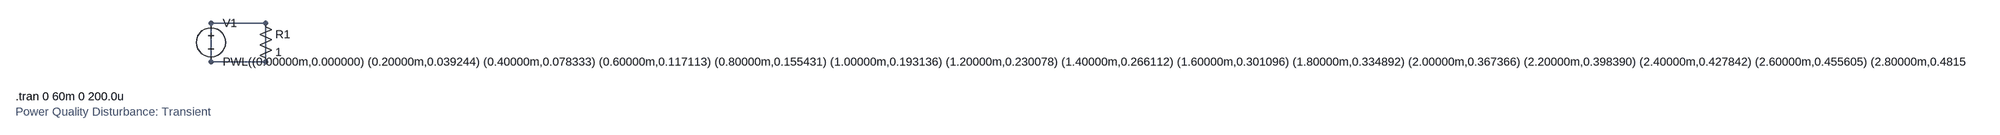
[diagram p0: schematic Transient.asc]
Transient.asc, the LTspice schematic file:
Version 4
SHEET 1 880 680
WIRE 192 128 80 128
WIRE 80 128 80 208
WIRE 192 208 80 208
WIRE 192 128 192 208
SYMBOL voltage 80 112 R0
WINDOW 123 0 0 Left 0
WINDOW 39 0 0 Left 0
SYMATTR InstName V1
SYMATTR Value PWL((0.00000m,0.000000) (0.20000m,0.039244) (0.40000m,0.078333) (0.60000m,0.117113) (0.80000m,0.155431) (1.00000m,0.193136) (1.20000m,0.230078) (1.40000m,0.266112) (1.60000m,0.301096) (1.80000m,0.334892) (2.00000m,0.367366) (2.20000m,0.398390) (2.40000m,0.427842) (2.60000m,0.455605) (2.80000m,0.481571) (3.00000m,0.505636) (3.20000m,0.527705) (3.40000m,0.547692) (3.60000m,0.565517) (3.80000m,0.581110) (4.00000m,0.594410) (4.20000m,0.605364) (4.40000m,0.613930) (4.60000m,0.620072) (4.80000m,0.623767) (5.00000m,0.625000) (5.20000m,0.623767) (5.40000m,0.620072) (5.60000m,0.613930) (5.80000m,0.605364) (6.00000m,0.594410) (6.20000m,0.581110) (6.40000m,0.565517) (6.60000m,0.547692) (6.80000m,0.527705) (7.00000m,0.505636) (7.20000m,0.481571) (7.40000m,0.455605) (7.60000m,0.427842) (7.80000m,0.398390) (8.00000m,0.367366) (8.20000m,0.334892) (8.40000m,0.301096) (8.60000m,0.266112) (8.80000m,0.230078) (9.00000m,0.193136) (9.20000m,0.155431) (9.40000m,0.117113) (9.60000m,0.078333) (9.80000m,0.039244) (10.00000m,0.000000) (10.20000m,-0.039244) (10.40000m,-0.078333) (10.60000m,-0.117113) (10.80000m,-0.155431) (11.00000m,-0.193136) (11.20000m,-0.230078) (11.40000m,-0.266112) (11.60000m,-0.301096) (11.80000m,-0.334892) (12.00000m,-0.367366) (12.20000m,-0.398390) (12.40000m,-0.427842) (12.60000m,-0.455605) (12.80000m,-0.481571) (13.00000m,-0.505636) (13.20000m,-0.527705) (13.40000m,-0.547692) (13.60000m,-0.565517) (13.80000m,-0.581110) (14.00000m,-0.594410) (14.20000m,-0.605364) (14.40000m,-0.613930) (14.60000m,-0.620072) (14.80000m,-0.623767) (15.00000m,-0.625000) (15.20000m,-0.623767) (15.40000m,-0.620072) (15.60000m,-0.613930) (15.80000m,-0.605364) (16.00000m,-0.594410) (16.20000m,-0.581110) (16.40000m,-0.565517) (16.60000m,-0.547692) (16.80000m,-0.527705) (17.00000m,-0.505636) (17.20000m,-0.481571) (17.40000m,-0.455605) (17.60000m,-0.427842) (17.80000m,-0.398390) (18.00000m,-0.367366) (18.20000m,-0.334892) (18.40000m,-0.301096) (18.60000m,-0.266112) (18.80000m,-0.230078) (19.00000m,-0.193136) (19.20000m,-0.155431) (19.40000m,-0.117113) (19.60000m,-0.078333) (19.80000m,-0.039244) (20.00000m,-0.000000) (20.20000m,0.039244) (20.40000m,0.078333) (20.60000m,0.117113) (20.80000m,0.155431) (21.00000m,0.193136) (21.20000m,0.230078) (21.40000m,0.266112) (21.60000m,0.301096) (21.80000m,0.334892) (22.00000m,0.367366) (22.20000m,0.398390) (22.40000m,0.427842) (22.60000m,0.455605) (22.80000m,0.481571) (23.00000m,0.505636) (23.20000m,0.527705) (23.40000m,0.547692) (23.60000m,0.565517) (23.80000m,0.581110) (24.00000m,0.594410) (24.20000m,0.605364) (24.40000m,0.613930) (24.60000m,0.620072) (24.80000m,0.623767) (25.00000m,0.625000) (25.20000m,0.623767) (25.40000m,0.620072) (25.60000m,0.613930) (25.80000m,0.605364) (26.00000m,0.594410) (26.20000m,0.581110) (26.40000m,0.565517) (26.60000m,0.547692) (26.80000m,0.527705) (27.00000m,0.505636) (27.20000m,0.481571) (27.40000m,0.455605) (27.60000m,0.427842) (27.80000m,0.398390) (28.00000m,0.367366) (28.20000m,0.334892) (28.40000m,0.301096) (28.60000m,0.266112) (28.80000m,0.230078) (29.00000m,0.193136) (29.20000m,0.155431) (29.40000m,0.117113) (29.60000m,0.078333) (29.80000m,0.039244) (30.00000m,1.000000) (30.20000m,0.328635) (30.40000m,0.057002) (30.60000m,-0.067326) (30.80000m,-0.137116) (31.00000m,-0.186398) (31.20000m,-0.227599) (31.40000m,-0.266112) (31.60000m,-0.301096) (31.80000m,-0.334892) (32.00000m,-0.367366) (32.20000m,-0.398390) (32.40000m,-0.427842) (32.60000m,-0.455605) (32.80000m,-0.481571) (33.00000m,-0.505636) (33.20000m,-0.527705) (33.40000m,-0.547692) (33.60000m,-0.565517) (33.80000m,-0.581110) (34.00000m,-0.594410) (34.20000m,-0.605364) (34.40000m,-0.613930) (34.60000m,-0.620072) (34.80000m,-0.623767) (35.00000m,-0.625000) (35.20000m,-0.623767) (35.40000m,-0.620072) (35.60000m,-0.613930) (35.80000m,-0.605364) (36.00000m,-0.594410) (36.20000m,-0.581110) (36.40000m,-0.565517) (36.60000m,-0.547692) (36.80000m,-0.527705) (37.00000m,-0.505636) (37.20000m,-0.481571) (37.40000m,-0.455605) (37.60000m,-0.427842) (37.80000m,-0.398390) (38.00000m,-0.367366) (38.20000m,-0.334892) (38.40000m,-0.301096) (38.60000m,-0.266112) (38.80000m,-0.230078) (39.00000m,-0.193136) (39.20000m,-0.155431) (39.40000m,-0.117113) (39.60000m,-0.078333) (39.80000m,-0.039244) (40.00000m,-0.000000) (40.20000m,0.039244) (40.40000m,0.078333) (40.60000m,0.117113) (40.80000m,0.155431) (41.00000m,0.193136) (41.20000m,0.230078) (41.40000m,0.266112) (41.60000m,0.301096) (41.80000m,0.334892) (42.00000m,0.367366) (42.20000m,0.398390) (42.40000m,0.427842) (42.60000m,0.455605) (42.80000m,0.481571) (43.00000m,0.505636) (43.20000m,0.527705) (43.40000m,0.547692) (43.60000m,0.565517) (43.80000m,0.581110) (44.00000m,0.594410) (44.20000m,0.605364) (44.40000m,0.613930) (44.60000m,0.620072) (44.80000m,0.623767) (45.00000m,0.625000) (45.20000m,0.623767) (45.40000m,0.620072) (45.60000m,0.613930) (45.80000m,0.605364) (46.00000m,0.594410) (46.20000m,0.581110) (46.40000m,0.565517) (46.60000m,0.547692) (46.80000m,0.527705) (47.00000m,0.505636) (47.20000m,0.481571) (47.40000m,0.455605) (47.60000m,0.427842) (47.80000m,0.398390) (48.00000m,0.367366) (48.20000m,0.334892) (48.40000m,0.301096) (48.60000m,0.266112) (48.80000m,0.230078) (49.00000m,0.193136) (49.20000m,0.155431) (49.40000m,0.117113) (49.60000m,0.078333) (49.80000m,0.039244) (50.00000m,0.000000) (50.20000m,-0.039244) (50.40000m,-0.078333) (50.60000m,-0.117113) (50.80000m,-0.155431) (51.00000m,-0.193136) (51.20000m,-0.230078) (51.40000m,-0.266112) (51.60000m,-0.301096) (51.80000m,-0.334892) (52.00000m,-0.367366) (52.20000m,-0.398390) (52.40000m,-0.427842) (52.60000m,-0.455605) (52.80000m,-0.481571) (53.00000m,-0.505636) (53.20000m,-0.527705) (53.40000m,-0.547692) (53.60000m,-0.565517) (53.80000m,-0.581110) (54.00000m,-0.594410) (54.20000m,-0.605364) (54.40000m,-0.613930) (54.60000m,-0.620072) (54.80000m,-0.623767) (55.00000m,-0.625000) (55.20000m,-0.623767) (55.40000m,-0.620072) (55.60000m,-0.613930) (55.80000m,-0.605364) (56.00000m,-0.594410) (56.20000m,-0.581110) (56.40000m,-0.565517) (56.60000m,-0.547692) (56.80000m,-0.527705) (57.00000m,-0.505636) (57.20000m,-0.481571) (57.40000m,-0.455605) (57.60000m,-0.427842) (57.80000m,-0.398390) (58.00000m,-0.367366) (58.20000m,-0.334892) (58.40000m,-0.301096) (58.60000m,-0.266112) (58.80000m,-0.230078) (59.00000m,-0.193136) (59.20000m,-0.155431) (59.40000m,-0.117113) (59.60000m,-0.078333) (59.80000m,-0.039244))
SYMBOL res 176 112 R0
SYMATTR InstName R1
SYMATTR Value 1
TEXT -320 280 Left 2 !.tran 0 60m 0 200.0u
TEXT -320 312 Left 2 ;Power Quality Disturbance: Transient

The netlist it stands for:
* Transient.asc
V1 N001 N001 PWL((0.00000m,0.000000) (0.20000m,0.039244) (0.40000m,0.078333) (0.60000m,0.117113) (0.80000m,0.155431) (1.00000m,0.193136) (1.20000m,0.230078) (1.40000m,0.266112) (1.60000m,0.301096) (1.80000m,0.334892) (2.00000m,0.367366) (2.20000m,0.398390) (2.40000m,0.427842) (2.60000m,0.455605) (2.80000m,0.481571) (3.00000m,0.505636) (3.20000m,0.527705) (3.40000m,0.547692) (3.60000m,0.565517) (3.80000m,0.581110) (4.00000m,0.594410) (4.20000m,0.605364) (4.40000m,0.613930) (4.60000m,0.620072) (4.80000m,0.623767) (5.00000m,0.625000) (5.20000m,0.623767) (5.40000m,0.620072) (5.60000m,0.613930) (5.80000m,0.605364) (6.00000m,0.594410) (6.20000m,0.581110) (6.40000m,0.565517) (6.60000m,0.547692) (6.80000m,0.527705) (7.00000m,0.505636) (7.20000m,0.481571) (7.40000m,0.455605) (7.60000m,0.427842) (7.80000m,0.398390) (8.00000m,0.367366) (8.20000m,0.334892) (8.40000m,0.301096) (8.60000m,0.266112) (8.80000m,0.230078) (9.00000m,0.193136) (9.20000m,0.155431) (9.40000m,0.117113) (9.60000m,0.078333) (9.80000m,0.039244) (10.00000m,0.000000) (10.20000m,-0.039244) (10.40000m,-0.078333) (10.60000m,-0.117113) (10.80000m,-0.155431) (11.00000m,-0.193136) (11.20000m,-0.230078) (11.40000m,-0.266112) (11.60000m,-0.301096) (11.80000m,-0.334892) (12.00000m,-0.367366) (12.20000m,-0.398390) (12.40000m,-0.427842) (12.60000m,-0.455605) (12.80000m,-0.481571) (13.00000m,-0.505636) (13.20000m,-0.527705) (13.40000m,-0.547692) (13.60000m,-0.565517) (13.80000m,-0.581110) (14.00000m,-0.594410) (14.20000m,-0.605364) (14.40000m,-0.613930) (14.60000m,-0.620072) (14.80000m,-0.623767) (15.00000m,-0.625000) (15.20000m,-0.623767) (15.40000m,-0.620072) (15.60000m,-0.613930) (15.80000m,-0.605364) (16.00000m,-0.594410) (16.20000m,-0.581110) (16.40000m,-0.565517) (16.60000m,-0.547692) (16.80000m,-0.527705) (17.00000m,-0.505636) (17.20000m,-0.481571) (17.40000m,-0.455605) (17.60000m,-0.427842) (17.80000m,-0.398390) (18.00000m,-0.367366) (18.20000m,-0.334892) (18.40000m,-0.301096) (18.60000m,-0.266112) (18.80000m,-0.230078) (19.00000m,-0.193136) (19.20000m,-0.155431) (19.40000m,-0.117113) (19.60000m,-0.078333) (19.80000m,-0.039244) (20.00000m,-0.000000) (20.20000m,0.039244) (20.40000m,0.078333) (20.60000m,0.117113) (20.80000m,0.155431) (21.00000m,0.193136) (21.20000m,0.230078) (21.40000m,0.266112) (21.60000m,0.301096) (21.80000m,0.334892) (22.00000m,0.367366) (22.20000m,0.398390) (22.40000m,0.427842) (22.60000m,0.455605) (22.80000m,0.481571) (23.00000m,0.505636) (23.20000m,0.527705) (23.40000m,0.547692) (23.60000m,0.565517) (23.80000m,0.581110) (24.00000m,0.594410) (24.20000m,0.605364) (24.40000m,0.613930) (24.60000m,0.620072) (24.80000m,0.623767) (25.00000m,0.625000) (25.20000m,0.623767) (25.40000m,0.620072) (25.60000m,0.613930) (25.80000m,0.605364) (26.00000m,0.594410) (26.20000m,0.581110) (26.40000m,0.565517) (26.60000m,0.547692) (26.80000m,0.527705) (27.00000m,0.505636) (27.20000m,0.481571) (27.40000m,0.455605) (27.60000m,0.427842) (27.80000m,0.398390) (28.00000m,0.367366) (28.20000m,0.334892) (28.40000m,0.301096) (28.60000m,0.266112) (28.80000m,0.230078) (29.00000m,0.193136) (29.20000m,0.155431) (29.40000m,0.117113) (29.60000m,0.078333) (29.80000m,0.039244) (30.00000m,1.000000) (30.20000m,0.328635) (30.40000m,0.057002) (30.60000m,-0.067326) (30.80000m,-0.137116) (31.00000m,-0.186398) (31.20000m,-0.227599) (31.40000m,-0.266112) (31.60000m,-0.301096) (31.80000m,-0.334892) (32.00000m,-0.367366) (32.20000m,-0.398390) (32.40000m,-0.427842) (32.60000m,-0.455605) (32.80000m,-0.481571) (33.00000m,-0.505636) (33.20000m,-0.527705) (33.40000m,-0.547692) (33.60000m,-0.565517) (33.80000m,-0.581110) (34.00000m,-0.594410) (34.20000m,-0.605364) (34.40000m,-0.613930) (34.60000m,-0.620072) (34.80000m,-0.623767) (35.00000m,-0.625000) (35.20000m,-0.623767) (35.40000m,-0.620072) (35.60000m,-0.613930) (35.80000m,-0.605364) (36.00000m,-0.594410) (36.20000m,-0.581110) (36.40000m,-0.565517) (36.60000m,-0.547692) (36.80000m,-0.527705) (37.00000m,-0.505636) (37.20000m,-0.481571) (37.40000m,-0.455605) (37.60000m,-0.427842) (37.80000m,-0.398390) (38.00000m,-0.367366) (38.20000m,-0.334892) (38.40000m,-0.301096) (38.60000m,-0.266112) (38.80000m,-0.230078) (39.00000m,-0.193136) (39.20000m,-0.155431) (39.40000m,-0.117113) (39.60000m,-0.078333) (39.80000m,-0.039244) (40.00000m,-0.000000) (40.20000m,0.039244) (40.40000m,0.078333) (40.60000m,0.117113) (40.80000m,0.155431) (41.00000m,0.193136) (41.20000m,0.230078) (41.40000m,0.266112) (41.60000m,0.301096) (41.80000m,0.334892) (42.00000m,0.367366) (42.20000m,0.398390) (42.40000m,0.427842) (42.60000m,0.455605) (42.80000m,0.481571) (43.00000m,0.505636) (43.20000m,0.527705) (43.40000m,0.547692) (43.60000m,0.565517) (43.80000m,0.581110) (44.00000m,0.594410) (44.20000m,0.605364) (44.40000m,0.613930) (44.60000m,0.620072) (44.80000m,0.623767) (45.00000m,0.625000) (45.20000m,0.623767) (45.40000m,0.620072) (45.60000m,0.613930) (45.80000m,0.605364) (46.00000m,0.594410) (46.20000m,0.581110) (46.40000m,0.565517) (46.60000m,0.547692) (46.80000m,0.527705) (47.00000m,0.505636) (47.20000m,0.481571) (47.40000m,0.455605) (47.60000m,0.427842) (47.80000m,0.398390) (48.00000m,0.367366) (48.20000m,0.334892) (48.40000m,0.301096) (48.60000m,0.266112) (48.80000m,0.230078) (49.00000m,0.193136) (49.20000m,0.155431) (49.40000m,0.117113) (49.60000m,0.078333) (49.80000m,0.039244) (50.00000m,0.000000) (50.20000m,-0.039244) (50.40000m,-0.078333) (50.60000m,-0.117113) (50.80000m,-0.155431) (51.00000m,-0.193136) (51.20000m,-0.230078) (51.40000m,-0.266112) (51.60000m,-0.301096) (51.80000m,-0.334892) (52.00000m,-0.367366) (52.20000m,-0.398390) (52.40000m,-0.427842) (52.60000m,-0.455605) (52.80000m,-0.481571) (53.00000m,-0.505636) (53.20000m,-0.527705) (53.40000m,-0.547692) (53.60000m,-0.565517) (53.80000m,-0.581110) (54.00000m,-0.594410) (54.20000m,-0.605364) (54.40000m,-0.613930) (54.60000m,-0.620072) (54.80000m,-0.623767) (55.00000m,-0.625000) (55.20000m,-0.623767) (55.40000m,-0.620072) (55.60000m,-0.613930) (55.80000m,-0.605364) (56.00000m,-0.594410) (56.20000m,-0.581110) (56.40000m,-0.565517) (56.60000m,-0.547692) (56.80000m,-0.527705) (57.00000m,-0.505636) (57.20000m,-0.481571) (57.40000m,-0.455605) (57.60000m,-0.427842) (57.80000m,-0.398390) (58.00000m,-0.367366) (58.20000m,-0.334892) (58.40000m,-0.301096) (58.60000m,-0.266112) (58.80000m,-0.230078) (59.00000m,-0.193136) (59.20000m,-0.155431) (59.40000m,-0.117113) (59.60000m,-0.078333) (59.80000m,-0.039244))
R1 N001 N001 1
.tran 0 60m 0 200.0u
* Power Quality Disturbance: Transient
.backanno
.end